# Altium project MiniRobot.PrjPcb
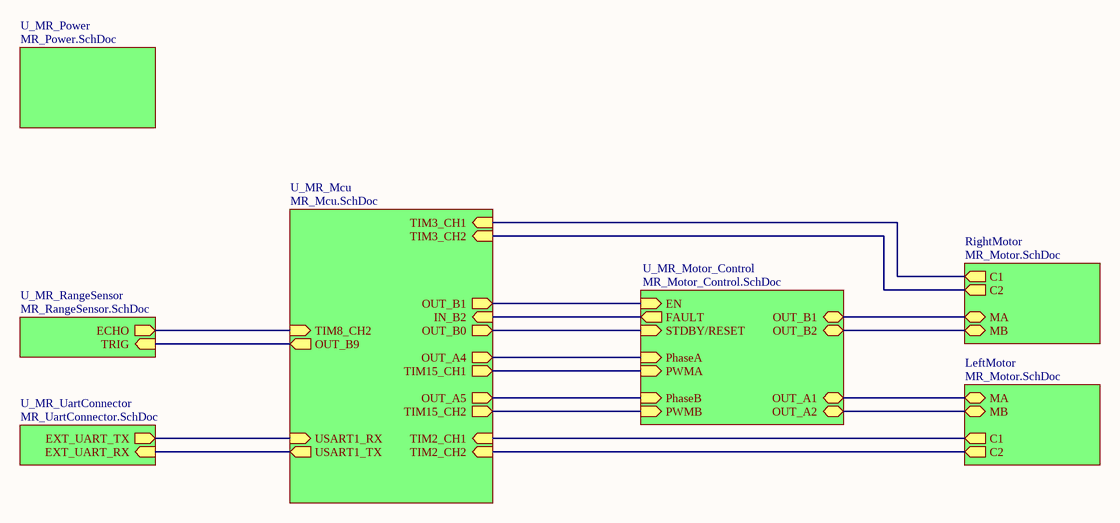
[diagram p0: MR_main.SchDoc]
7 sheets, 52 parts. Net scope: hierarchical (ports join the sheet entries above them; power ports are global).
Board file: MiniRobot.PcbDoc
Sheets:
  MR_main.SchDoc
    U_MR_Mcu = MR_Mcu.SchDoc
    U_MR_Motor_Control = MR_Motor_Control.SchDoc
    U_MR_Power = MR_Power.SchDoc
    RightMotor = MR_Motor.SchDoc
    LeftMotor = MR_Motor.SchDoc
    U_MR_RangeSensor = MR_RangeSensor.SchDoc
    U_MR_UartConnector = MR_UartConnector.SchDoc

## Sheet MR_main.SchDoc
size A4; CompanyName: BeeIonic; SheetNumber: 1; SheetTotal: 7

### Sub-sheets
LeftMotor = MR_Motor.SchDoc: MA (bidir), C1 (out), C2 (out), MB (bidir)
RightMotor = MR_Motor.SchDoc: MA (bidir), C1 (out), C2 (out), MB (bidir)
U_MR_Mcu = MR_Mcu.SchDoc: TIM15_CH2 (out), TIM2_CH1 (in), TIM3_CH2 (in), TIM2_CH2 (in), USART1_RX (in), TIM15_CH1 (out), TIM3_CH1 (in), USART1_TX (out), OUT_B1 (out), OUT_A4 (out), OUT_A5 (out), IN_B2 (in), OUT_B0 (out), TIM8_CH2 (in), OUT_B9 (out)
U_MR_Motor_Control = MR_Motor_Control.SchDoc: OUT_A1 (bidir), PWMB (in), OUT_B1 (bidir), OUT_A2 (bidir), OUT_B2 (bidir), FAULT (out), PhaseA (in), PhaseB (in), STDBY/RESET (in), EN (in), PWMA (in)
U_MR_Power = MR_Power.SchDoc: no entries
U_MR_RangeSensor = MR_RangeSensor.SchDoc: ECHO (out), TRIG (in)
U_MR_UartConnector = MR_UartConnector.SchDoc: EXT_UART_RX (in), EXT_UART_TX (out)

### Nets
NetC3_2: sheet U_MR_Mcu/IN_B2, sheet U_MR_Motor_Control/FAULT
NetH1_1_1: sheet U_MR_Motor_Control/OUT_A1, sheet LeftMotor/MA
NetH1_1_6: sheet U_MR_Motor_Control/OUT_A2, sheet LeftMotor/MB
NetH1_2_1: sheet U_MR_Motor_Control/OUT_B1, sheet RightMotor/MA
NetH1_2_6: sheet U_MR_Motor_Control/OUT_B2, sheet RightMotor/MB
NetH2_4: sheet U_MR_Mcu/USART1_TX, sheet U_MR_UartConnector/EXT_UART_RX
NetM2_3: sheet U_MR_Mcu/OUT_B9, sheet U_MR_RangeSensor/TRIG
NetR1_1_1: sheet U_MR_Mcu/TIM2_CH1, sheet LeftMotor/C1
NetR1_2_1: sheet U_MR_Mcu/TIM3_CH1, sheet RightMotor/C1
NetR2_1_1: sheet U_MR_Mcu/TIM2_CH2, sheet LeftMotor/C2
NetR2_2_1: sheet U_MR_Mcu/TIM3_CH2, sheet RightMotor/C2
NetR3_2: sheet U_MR_Mcu/OUT_B1, sheet U_MR_Motor_Control/EN
NetR12_1: sheet U_MR_Mcu/TIM8_CH2, sheet U_MR_RangeSensor/ECHO
NetR13_1: sheet U_MR_Mcu/TIM15_CH1, sheet U_MR_Motor_Control/PWMA
NetR14_1: sheet U_MR_Mcu/TIM15_CH2, sheet U_MR_Motor_Control/PWMB
NetR15_1: sheet U_MR_Mcu/OUT_A4, sheet U_MR_Motor_Control/PhaseA
NetR16_1: sheet U_MR_Mcu/OUT_A5, sheet U_MR_Motor_Control/PhaseB
NetR17_1: sheet U_MR_Mcu/OUT_B0, sheet U_MR_Motor_Control/STDBY/RESET
NetR20_1: sheet U_MR_Mcu/USART1_RX, sheet U_MR_UartConnector/EXT_UART_TX

### Notes on the sheet
- Project :
- Title :
- Sheet:
- of
- Creation Date :
- Designer :
- Modified Date :

## Sheet MR_Mcu.SchDoc
size A4; CompanyName: BeeIonic; SheetNumber: 4; SheetTotal: 7
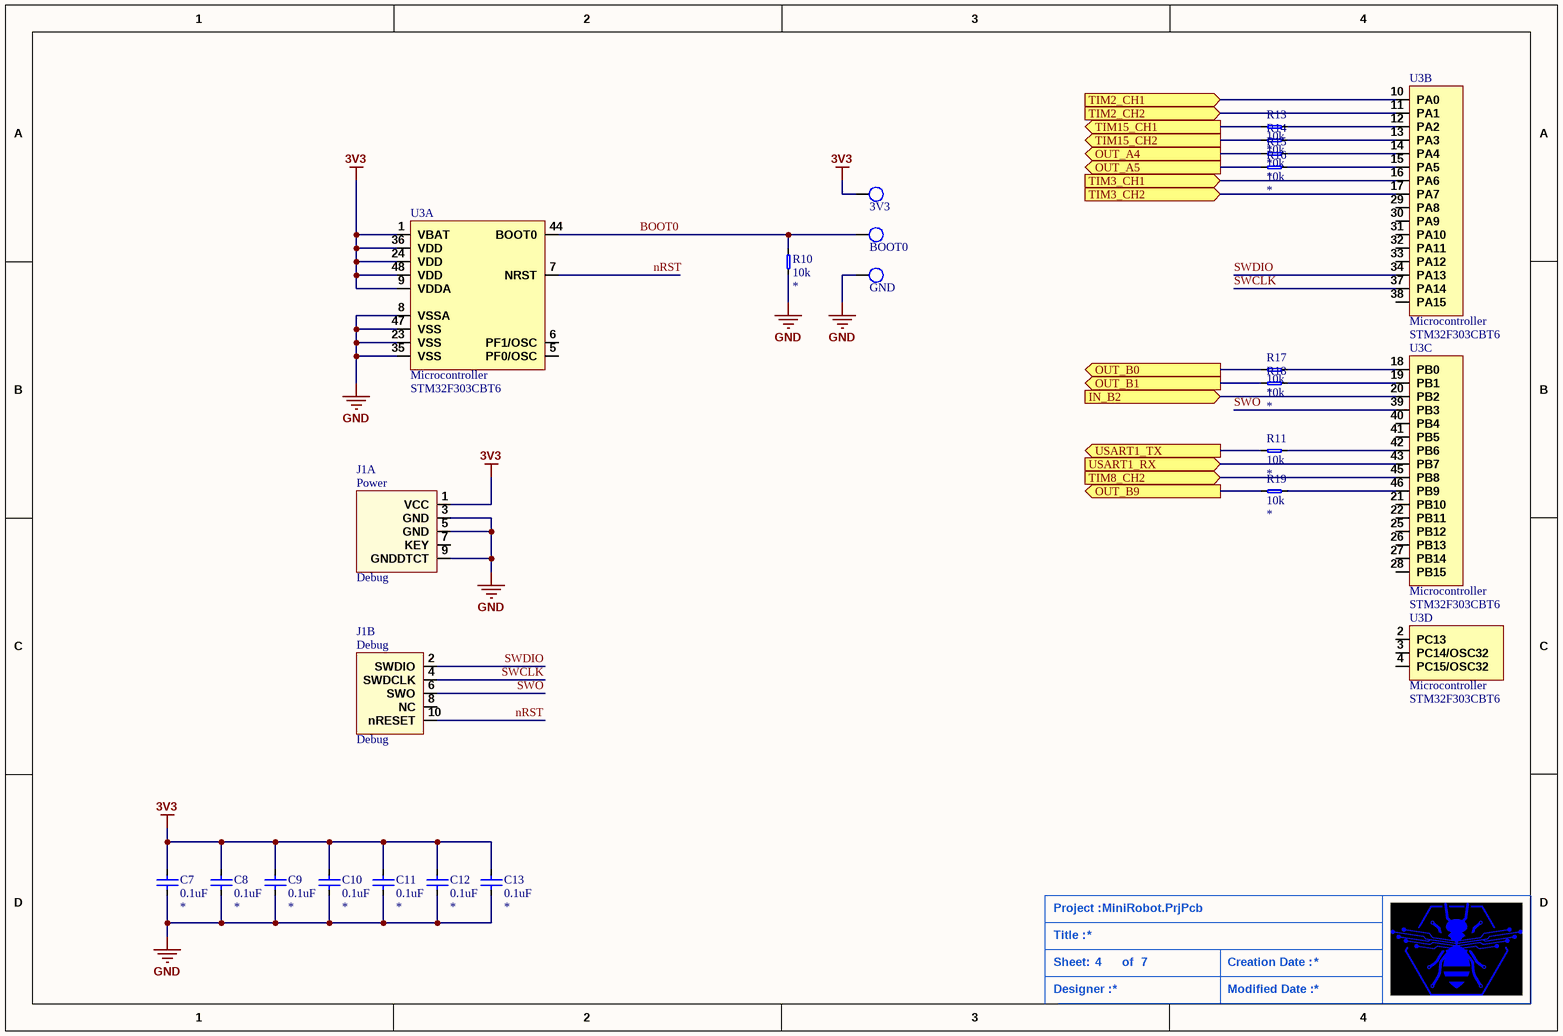
[diagram p1: MR_Mcu.SchDoc]

### Parts
3V3  TestPoint  [ROUND_TEST_POINT]  (value not drawn)  (no BOM)
BOOT0  TestPoint  [ROUND_TEST_POINT]  (value not drawn)  (no BOM)
C7  value 0.1uF  [0603_CAP_LD]  (hidden comment: CerCap)
C8  value 0.1uF  [0603_CAP_LD]  (hidden comment: CerCap)
C9  value 0.1uF  [0603_CAP_LD]  (hidden comment: CerCap)
C10  value 0.1uF  [0603_CAP_LD]  (hidden comment: CerCap)
C11  value 0.1uF  [0603_CAP_LD]  (hidden comment: CerCap)
C12  value 0.1uF  [0603_CAP_LD]  (hidden comment: CerCap)
C13  value 0.1uF  [0603_CAP_LD]  (hidden comment: CerCap)
GND  TestPoint  [ROUND_TEST_POINT]  (value not drawn)  (no BOM)
J1  Debug  [62201021121]  (parts A,B of 2)
R10  value 10k  [0603_RES_LD]  (hidden comment: Resistor)
R11  value 10k  [0603_RES_LD]  (hidden comment: Resistor)
R13  value 10k  [0603_RES_LD]  (hidden comment: Resistor)
R14  value 10k  [0603_RES_LD]  (hidden comment: Resistor)
R15  value 10k  [0603_RES_LD]  (hidden comment: Resistor)
R16  value 10k  [0603_RES_LD]  (hidden comment: Resistor)
R17  value 10k  [0603_RES_LD]  (hidden comment: Resistor)
R18  value 10k  [0603_RES_LD]  (hidden comment: Resistor)
R19  value 10k  [0603_RES_LD]  (hidden comment: Resistor)
U3  Microcontroller  [STM32_LQFP48]  (parts A,B,C,D of 4)

### Ports
IN_B2 (in), OUT_A4 (out), OUT_A5 (out), OUT_B0 (out), OUT_B1 (out), OUT_B9 (out), TIM2_CH1 (in), TIM2_CH2 (in), TIM3_CH1 (in), TIM3_CH2 (in), TIM8_CH2 (in), TIM15_CH1 (out), TIM15_CH2 (out), USART1_RX (in), USART1_TX (out)

### Nets
3V3: 3V3.1(TP) C7.2 C8.2 C9.2 C10.2 C11.2 C12.2 C13.2 J1.1(VCC) U3.1(VBAT) U3.9(VDDA) U3.24(VDD) U3.36(VDD) U3.48(VDD)
GND: C7.1 C8.1 C9.1 C10.1 C11.1 C12.1 C13.1 GND.1(TP) J1.3(GND) J1.5(GND) J1.9(GNDDTCT) R10.1 U3.8(VSSA) U3.23(VSS) U3.35(VSS) U3.47(VSS)
BOOT0: BOOT0.1(TP) R10.2 U3.44(BOOT0)
nRST: J1.10(nRESET) U3.7(NRST)
SWCLK: J1.4(SWDCLK) U3.37(PA14)
SWDIO: J1.2(SWDIO) U3.34(PA13)
SWO: J1.6(SWO) U3.39(PB3)
NetC3_2: U3.20(PB2) ; port IN_B2
NetH2_4: R11.1 ; port USART1_TX
NetM2_3: R19.1 ; port OUT_B9
NetR1_1_1: U3.10(PA0) ; port TIM2_CH1
NetR1_2_1: U3.16(PA6) ; port TIM3_CH1
NetR2_1_1: U3.11(PA1) ; port TIM2_CH2
NetR2_2_1: U3.17(PA7) ; port TIM3_CH2
NetR3_2: R18.1 ; port OUT_B1
NetR11_2: R11.2 U3.42(PB6)
NetR12_1: U3.45(PB8) ; port TIM8_CH2
NetR13_1: R13.1 ; port TIM15_CH1
NetR13_2: R13.2 U3.12(PA2)
NetR14_1: R14.1 ; port TIM15_CH2
NetR14_2: R14.2 U3.13(PA3)
NetR15_1: R15.1 ; port OUT_A4
NetR15_2: R15.2 U3.14(PA4)
NetR16_1: R16.1 ; port OUT_A5
NetR16_2: R16.2 U3.15(PA5)
NetR17_1: R17.1 ; port OUT_B0
NetR17_2: R17.2 U3.18(PB0)
NetR18_2: R18.2 U3.19(PB1)
NetR19_2: R19.2 U3.46(PB9)
NetR20_1: U3.43(PB7) ; port USART1_RX

Not connected (* = marked no-connect by the designer): J1 7(KEY) 8(NC); U3 2(PC13) 3(PC14/OSC32) 4(PC15/OSC32) 5(PF0/OSC) 6(PF1/OSC) 21(PB10) 22(PB11) 25(PB12) 26(PB13) 27(PB14) 28(PB15) 29(PA8) 30(PA9) 31(PA10) 32(PA11) 33(PA12) 38(PA15) 40(PB4) 41(PB5)

### Notes on the sheet
- Project :
- Title :
- Sheet:
- of
- Creation Date :
- Designer :
- Modified Date :
- (in symbol Cortex_10x2, part A) Power

### Library data of the parts
C7-C13 = CerCap: Ceramic Capacitor; Type: *; Voltage/Power: *; Package: *
J1 = Cortex_10x2: Cortex 10 pins Debug Connector
U3 = STM32F303CBT6: STM32F303 Microcontroller; Reference: STM32F303CBT6
R10 R11 R13-R19 = Resistor: Precision: *; Package: *

## Sheet MR_Motor_Control.SchDoc
size A4; CompanyName: BeeIonic; SheetNumber: 3; SheetTotal: 7
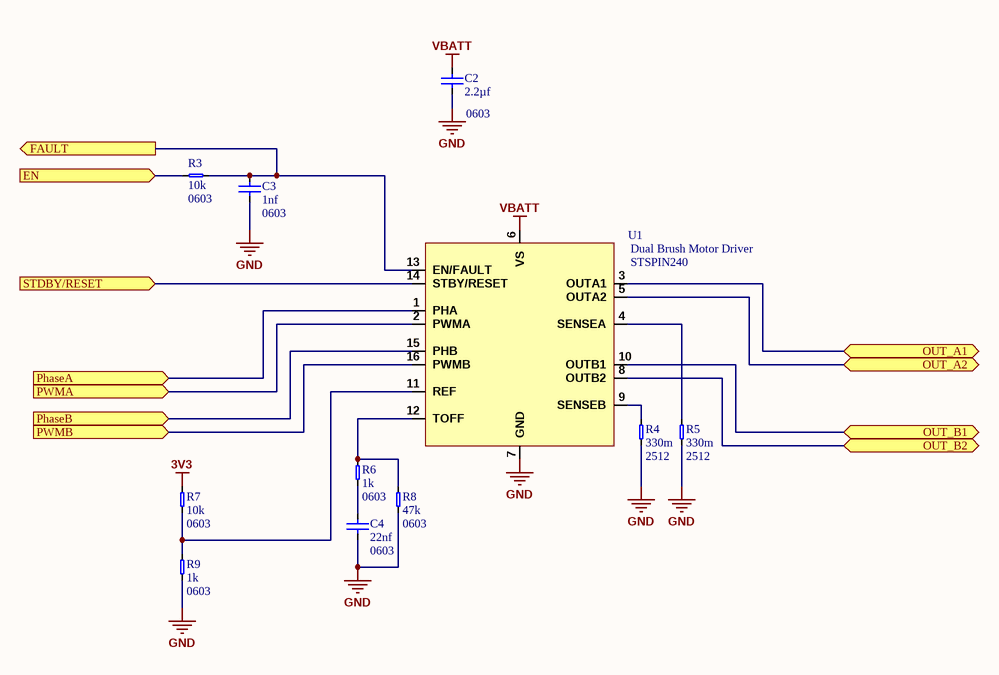
[diagram p2: MR_Motor_Control.SchDoc]

### Parts
C2  value 2.2µf  Package: 0603  [0603_CAP_LD]  (hidden comment: CerCap)
C3  value 1nf  Package: 0603  [0603_CAP_LD]  (hidden comment: CerCap)
C4  value 22nf  Package: 0603  [0603_CAP_LD]  (hidden comment: CerCap)
R3  value 10k  Package: 0603  [0603_RES_LD]  (hidden comment: Resistor)
R4  value 330m  Package: 2512  [2512_RES_LD]  (hidden comment: Resistor)
R5  value 330m  Package: 2512  [2512_RES_LD]  (hidden comment: Resistor)
R6  value 1k  Package: 0603  [0603_RES_LD]  (hidden comment: Resistor)
R7  value 10k  Package: 0603  [0603_RES_LD]  (hidden comment: Resistor)
R8  value 47k  Package: 0603  [0603_RES_LD]  (hidden comment: Resistor)
R9  value 1k  Package: 0603  [0603_RES_LD]  (hidden comment: Resistor)
U1  Dual Brush Motor Driver  [QFN-STSPIN240]

### Ports
EN (in), FAULT (out), OUT_A1 (bidir), OUT_A2 (bidir), OUT_B1 (bidir), OUT_B2 (bidir), PhaseA (in), PhaseB (in), PWMA (in), PWMB (in), STDBY/RESET (in)

### Nets
3V3: R7.2
GND: C2.1 C3.1 C4.1 R4.1 R5.1 R8.1 R9.1 U1.7(GND)
VBATT: C2.2 U1.6(VS)
NetC3_2: C3.2 R3.1 U1.13(EN/FAULT) ; port FAULT
NetC4_2: C4.2 R6.1
NetH1_1_1: U1.3(OUTA1) ; port OUT_A1
NetH1_1_6: U1.5(OUTA2) ; port OUT_A2
NetH1_2_1: U1.10(OUTB1) ; port OUT_B1
NetH1_2_6: U1.8(OUTB2) ; port OUT_B2
NetR3_2: R3.2 ; port EN
NetR4_2: R4.2 U1.9(SENSEB)
NetR5_2: R5.2 U1.4(SENSEA)
NetR6_2: R6.2 R8.2 U1.12(TOFF)
NetR7_1: R7.1 R9.2 U1.11(REF)
NetR13_1: U1.2(PWMA) ; port PWMA
NetR14_1: U1.16(PWMB) ; port PWMB
NetR15_1: U1.1(PHA) ; port PhaseA
NetR16_1: U1.15(PHB) ; port PhaseB
NetR17_1: U1.14(STBY/RESET) ; port STDBY/RESET

### Notes on the sheet
- Project :
- Title :
- Sheet:
- of
- Creation Date :
- Designer :
- Modified Date :

### Library data of the parts
C2-C4 = CerCap: Ceramic Capacitor; Type: *; Voltage/Power: *
U1 = STSPIN240: ST Dual Motor Driver; Reference: STSPIN240
R3-R9 = Resistor: Precision: *

## Sheet MR_Power.SchDoc
size A4; CompanyName: BeeIonic; SheetNumber: 5; SheetTotal: 7
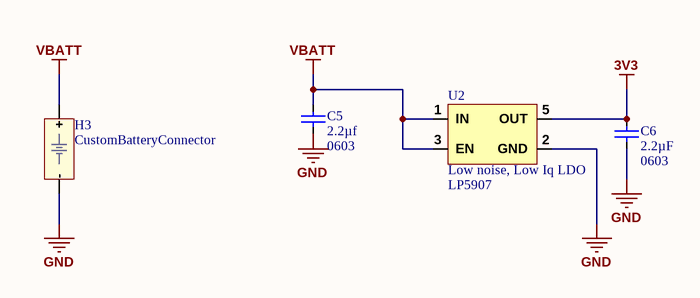
[diagram p3: MR_Power.SchDoc]

### Parts
C5  value 2.2µf  Package: 0603  [0603_CAP_LD]  (hidden comment: CerCap)
C6  value 2.2µF  Package: 0603  [0603_CAP_LD]  (hidden comment: CerCap)
H3  CustomBatteryConnector  [CustomBatteryConnector]
U2  Low noise, Low Iq LDO  [LP5907]

### Nets
3V3: C6.2 U2.5(OUT)
GND: C5.1 C6.1 H3.- U2.2(GND)
VBATT: C5.2 H3.+ U2.1(IN) U2.3(EN)

Not connected (* = marked no-connect by the designer): U2 4(NC)

### Notes on the sheet
- Project :
- Title :
- Sheet:
- of
- Creation Date :
- Designer :
- Modified Date :

### Library data of the parts
C5 C6 = CerCap: Ceramic Capacitor; Type: *; Voltage/Power: *
H3 = BatteryConnector: Custom Battery Connector
U2 = LP5907: LP5907 Low Noise Low Iq LDO; Reference: LP5907

## Sheet MR_Motor.SchDoc
size A4; CompanyName: BeeIonic; SheetNumber: 2; SheetTotal: 7
Used 2 times, as channels RightMotor, LeftMotor. Parts and nets are listed once, with the designators drawn on the sheet.
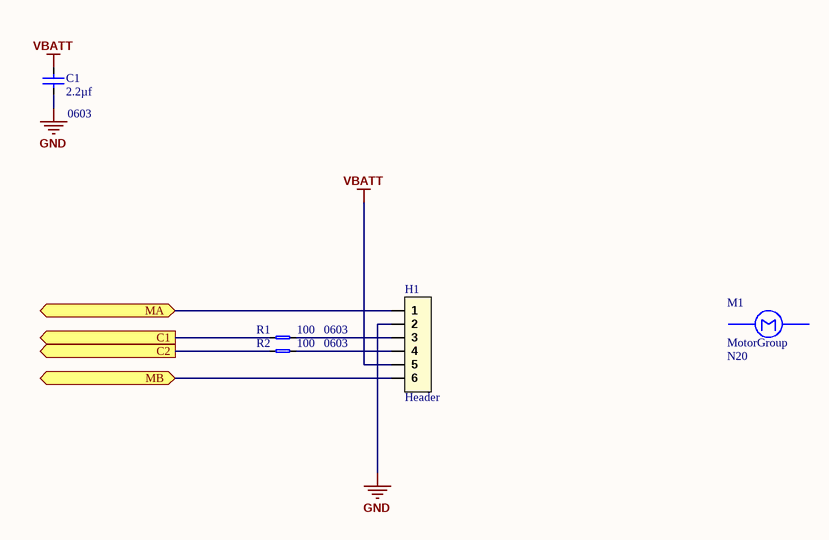
[diagram p4: MR_Motor.SchDoc]

### Parts
C1  value 2.2µf  Package: 0603  [0603_CAP_LD]  (hidden comment: CerCap)
H1  Header  [HEADER_1X6_PICOBLADE_653106124022]
M1  MotorGroup  Reference: N20  [MotorGroup]
R1  value 100  Package: 0603  [0603_RES_LD]  (hidden comment: Resistor)
R2  value 100  Package: 0603  [0603_RES_LD]  (hidden comment: Resistor)

### Ports
C1 (out), C2 (out), MA (bidir), MB (bidir)

### Nets
GND: C1.1 H1.2
VBATT: C1.2 H1.5
C1: R1.1 ; port C1
C2: R2.1 ; port C2
MA: H1.1 ; port MA
MB: H1.6 ; port MB
NetH1_3: H1.3 R1.2
NetH1_4: H1.4 R2.2

### Channels
RightMotor: designators end in _2; ports C1=NetR1_2_1 C2=NetR2_2_1 MA=NetH1_2_1 MB=NetH1_2_6
LeftMotor: designators end in _1; ports C1=NetR1_1_1 C2=NetR2_1_1 MA=NetH1_1_1 MB=NetH1_1_6

### Notes on the sheet
- Project :
- Title :
- Sheet:
- of
- Creation Date :
- Designer :
- Modified Date :

### Library data of the parts
C1 = CerCap: Ceramic Capacitor; Type: *; Voltage/Power: *
H1 = Header_6x1: Header 6x1 Pins
M1 = Motor: N20 Motor Group
R1 R2 = Resistor: Precision: *

## Sheet MR_RangeSensor.SchDoc
size A4; CompanyName: BeeIonic; SheetNumber: 6; SheetTotal: 7
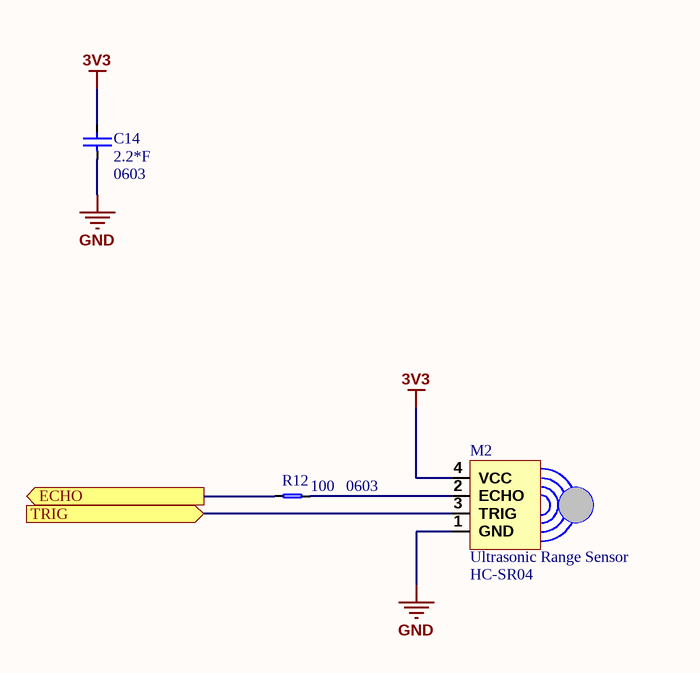
[diagram p5: MR_RangeSensor.SchDoc]

### Parts
C14  value 2.2*F  Package: 0603  [0603_CAP_LD]  (hidden comment: CerCap)
M2  Ultrasonic Range Sensor  [HC-SR04]
R12  value 100  Package: 0603  [0603_RES_LD]  (hidden comment: Resistor)

### Ports
ECHO (out), TRIG (in)

### Nets
3V3: C14.2 M2.4(VCC)
GND: C14.1 M2.1(GND)
NetM2_2: M2.2(ECHO) R12.2
NetM2_3: M2.3(TRIG) ; port TRIG
NetR12_1: R12.1 ; port ECHO

### Notes on the sheet
- Project :
- Title :
- Sheet:
- of
- Creation Date :
- Designer :
- Modified Date :

### Library data of the parts
C14 = CerCap: Ceramic Capacitor; Type: *; Voltage/Power: *
M2 = HC-SR04: Reference: HC-SR04
R12 = Resistor: Precision: *

## Sheet MR_UartConnector.SchDoc
size A4; CompanyName: BeeIonic; SheetNumber: 7; SheetTotal: 7
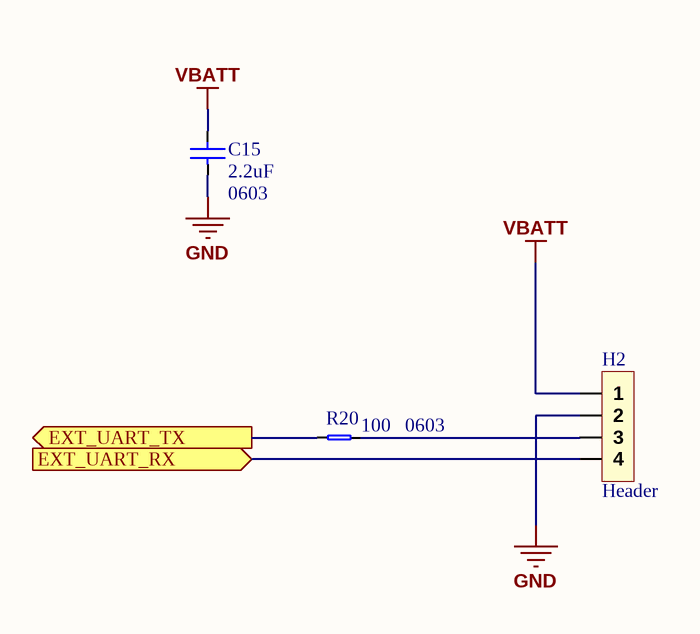
[diagram p6: MR_UartConnector.SchDoc]

### Parts
C15  value 2.2uF  Package: 0603  [0603_CAP_LD]  (hidden comment: CerCap)
H2  Header  [HE14 1x4 Straight]
R20  value 100  Package: 0603  [0603_RES_LD]  (hidden comment: Resistor)

### Ports
EXT_UART_RX (in), EXT_UART_TX (out)

### Nets
GND: C15.1 H2.2
VBATT: C15.2 H2.1
NetH2_3: H2.3 R20.2
NetH2_4: H2.4 ; port EXT_UART_RX
NetR20_1: R20.1 ; port EXT_UART_TX

### Notes on the sheet
- Project :
- Title :
- Sheet:
- of
- Creation Date :
- Designer :
- Modified Date :

### Library data of the parts
C15 = CerCap: Ceramic Capacitor; Type: *; Voltage/Power: *
H2 = Header_4x1: Header 4x1 PIns
R20 = Resistor: Precision: *

## Nets that join several sheets
3V3: MR_Mcu (14 pins), MR_Motor_Control (R7.2), MR_Power (C6.2 U2.5), MR_RangeSensor (C14.2 M2.4)
GND: MR_Mcu (16 pins), MR_Motor_Control (8 pins), MR_Power (C5.1 C6.1 H3.- U2.2), RightMotor (C1_2.1 H1_2.2), LeftMotor (C1_1.1 H1_1.2), MR_RangeSensor (C14.1 M2.1), MR_UartConnector (C15.1 H2.2)
VBATT: MR_Motor_Control (C2.2 U1.6), MR_Power (C5.2 H3.+ U2.1 U2.3), RightMotor (C1_2.2 H1_2.5), LeftMotor (C1_1.2 H1_1.5), MR_UartConnector (C15.2 H2.1)
NetC3_2: MR_Mcu (U3.20), MR_Motor_Control (C3.2 R3.1 U1.13)
NetH1_1_1: MR_Motor_Control (U1.3), LeftMotor (H1_1.1)
NetH1_1_6: MR_Motor_Control (U1.5), LeftMotor (H1_1.6)
NetH1_2_1: MR_Motor_Control (U1.10), RightMotor (H1_2.1)
NetH1_2_6: MR_Motor_Control (U1.8), RightMotor (H1_2.6)
NetH2_4: MR_Mcu (R11.1), MR_UartConnector (H2.4)
NetM2_3: MR_Mcu (R19.1), MR_RangeSensor (M2.3)
NetR1_1_1: MR_Mcu (U3.10), LeftMotor (R1_1.1)
NetR1_2_1: MR_Mcu (U3.16), RightMotor (R1_2.1)
NetR2_1_1: MR_Mcu (U3.11), LeftMotor (R2_1.1)
NetR2_2_1: MR_Mcu (U3.17), RightMotor (R2_2.1)
NetR3_2: MR_Mcu (R18.1), MR_Motor_Control (R3.2)
NetR12_1: MR_Mcu (U3.45), MR_RangeSensor (R12.1)
NetR13_1: MR_Mcu (R13.1), MR_Motor_Control (U1.2)
NetR14_1: MR_Mcu (R14.1), MR_Motor_Control (U1.16)
NetR15_1: MR_Mcu (R15.1), MR_Motor_Control (U1.1)
NetR16_1: MR_Mcu (R16.1), MR_Motor_Control (U1.15)
NetR17_1: MR_Mcu (R17.1), MR_Motor_Control (U1.14)
NetR20_1: MR_Mcu (U3.43), MR_UartConnector (R20.1)